# EAGLE design LiPower-Shield (EAGLE 6.4)
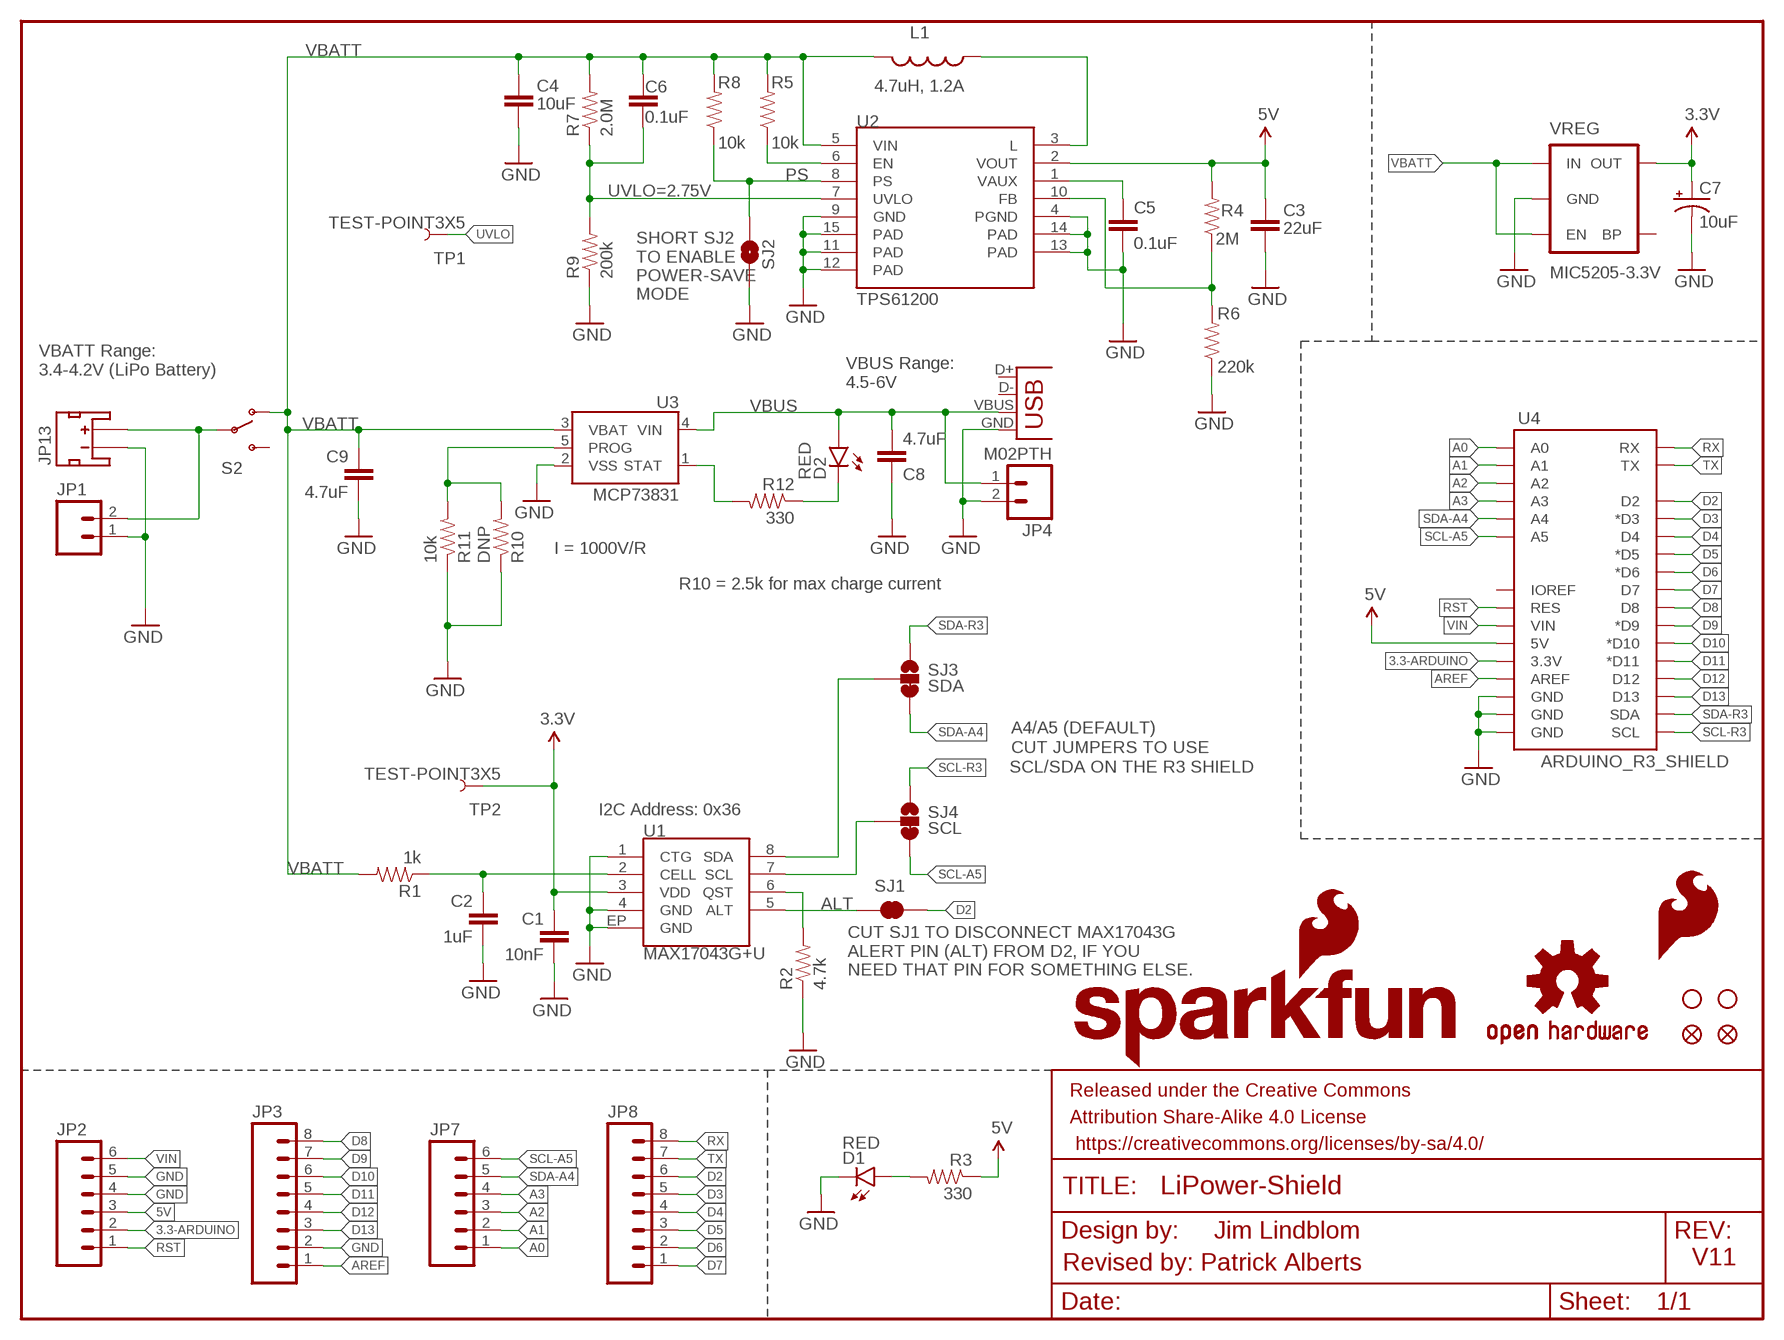
[diagram p0: schematic, sheet 1]

## Parts
C1  10nF  10NF/10000PF-50V-10%(0603)  [0603-CAP]
C2  1uF  1.0UF-16V-10%(0603)  [0603-CAP]
C3  22uF  22UF-6.3V-20%(0805)  [0805]
C4  10uF  10UF-6.3V-20%(1206)  [1206]
C5  0.1uF  0.1UF-25V(+80/-20%)(0603)  [0603-CAP]
C6  0.1uF  0.1UF-25V(+80/-20%)(0603)  [0603-CAP]
C7  10uF  10UF-16V-10%(TANT)  [EIA3216]
C8  4.7uF  4.7UF-6.3V-10%(0603)0603  [0603-CAP]
C9  4.7uF  4.7UF-6.3V-10%(0603)0603  [0603-CAP]
D1  RED  LED-RED0603  [LED-0603]
D2  RED  LED-RED0603  [LED-0603]
FID1  FIDUCIAL1X2  [FIDUCIAL-1X2]
FID2  FIDUCIAL1X2  [FIDUCIAL-1X2]
FRAME1  FRAME-LETTER  [CREATIVE_COMMONS]
JP1  M021X02_NO_SILK  [1X02_NO_SILK]
JP2  M06NO_SILK  [1X06_NO_SILK]
JP3  M08NO_SILK  [1X08_NO_SILK]
JP4  M02PTH  [1X02]
JP7  M06NO_SILK  [1X06_NO_SILK]
JP8  M08NO_SILK  [1X08_NO_SILK]
JP9  STAND-OFFTIGHT  [STAND-OFF-TIGHT]
JP10  STAND-OFFTIGHT  [STAND-OFF-TIGHT]
JP11  USBSMD  [USB-MINIB]
JP13  JST_2MM_MALE  [JST-2-SMD]
L1  4.7uH, 1.2A  INDUCTORINDUCTOR_4.7UH  [INDUCTOR_4.7UH]
LOGO1  OSHW-LOGOS  [OSHW-LOGO-S]
LOGO2  SFE_LOGO_NAME_FLAME.2_INCH  [SFE_LOGO_NAME_FLAME_.2]
LOGO3  SFE_LOGO_FLAME.1_INCH  [SFE_LOGO_FLAME_.1]
R1  1k  1KOHM1/10W1%(0603)  [0603-RES]
R2  4.7k  4.7KOHM1/10W1%(0603)  [0603-RES]
R3  330  330OHM1/10W1%(0603)  [0603-RES]
R4  2M  2MOHMS-1/10W-1%(0603)  [0603-RES]
R5  10k  10KOHM1/10W1%(0603)0603  [0603-RES]
R6  220k  220KOHM1/10W1%(0603)  [0603-RES]
R7  2.0M  2MOHMS-1/10W-1%(0603)  [0603-RES]
R8  10k  10KOHM1/10W1%(0603)0603  [0603-RES]
R9  200k  200KOHM1/10W1%(0603)200K  [0603-RES]
R10  DNP  RESISTORPTH-1/6W  [1/6W-RES]
R11  10k  10KOHM1/10W1%(0603)0603  [0603-RES]
R12  330  330OHM1/10W1%(0603)  [0603-RES]
S2  SWITCH-SPDT-SMD-A  [SWITCH-SPST-SMD-A]
SJ1  SOLDERJUMPERTRACE  [SJ_2S-TRACE]
SJ2  PS  SOLDERJUMPERNO  [SJ_2S-NO]
SJ3  SDA  JUMPER-PAD-3-2OF3_NC_BY_TRACE  [PAD-JUMPER-3-2OF3_NC_BY_TRACE_YES_SILK_FULL_BOX]
SJ4  SCL  JUMPER-PAD-3-2OF3_NC_BY_TRACE  [PAD-JUMPER-3-2OF3_NC_BY_TRACE_YES_SILK_FULL_BOX]
TP1  TEST-POINT3X5  [PAD.03X.05]
TP2  TEST-POINT3X5  [PAD.03X.05]
U1  MAX17043G+U  MAX1704X  [TDFN-8]
U2  TPS61200  [QFN-10_PAD]
U3  MCP73831  [SOT23-5]
U4  ARDUINO_R3_SHIELD  [UNO_R3_SHIELD]
VREG  MIC5205-3.3V  MIC52053.3V  [SOT23-5]

## Nets
3.3-ARDUINO: JP2.2 U4.3.3V
3.3V: C1.1 C7.A(+) TP2.P$1 U1.3(VDD) VREG.5(OUT)
5V: C3.1 JP2.3 R3.1 R4.2 U2.2(VOUT) U4.5V
A0: JP7.1 U4.A0
A1: JP7.2 U4.A1
A2: JP7.3 U4.A2
A3: JP7.4 U4.A3
ALT: SJ1.1 U1.5(ALT)
AREF: JP3.1 U4.AREF
CELL: C2.1 R1.1 U1.2(CELL)
D2: JP8.6 SJ1.2 U4.D2
D3: JP8.5 U4.D3(*D3)
D4: JP8.4 U4.D4
D5: JP8.3 U4.D5(*D5)
D6: JP8.2 U4.D6(*D6)
D7: JP8.1 U4.D7
D8: JP3.8 U4.D8
D9: JP3.7 U4.D9(*D9)
D10: JP3.6 U4.D10(*D10)
D11: JP3.5 U4.D11(*D11)
D12: JP3.4 U4.D12
D13: JP3.3 U4.D13
EN: R5.1 U2.6(EN)
FB: R4.1 R6.2 U2.10(FB)
GND: C1.2 C2.2 C3.2 C4.2 C5.2 C7.C(-) C8.1 C9.2 D1.C JP1.1 JP2.4 JP2.5 JP3.2 JP4.2 JP11.GND JP13.1(-) R2.1 R6.1 R9.1 R10.1 R11.1 SJ2.1 U1.1(CTG) U1.4(GND) U1.EP(GND) U2.4(PGND) U2.9(GND) U2.11(PAD) U2.12(PAD) U2.13(PAD) U2.14(PAD) U2.15(PAD) U3.2(VSS) U4.GND@0(GND) U4.GND@1(GND) U4.GND@2(GND) VREG.2(GND)
N$1: D1.A R3.2
N$3: L1.P$1 U2.3(L)
N$4: C5.1 U2.1(VAUX)
N$5: D2.C R12.1
N$7: JP1.2 JP13.2(+) S2.2(P)
N$20: SJ3.2 U1.8(SDA)
PROG: R10.2 R11.2 U3.5(PROG)
PS: R8.1 SJ2.2 U2.8(PS)
QST: R2.2 U1.6(QST)
RST: JP2.1 U4.RES
RX: JP8.8 U4.RX
SCL: SJ4.2 U1.7(SCL)
SCL-A5: JP7.6 SJ4.3 U4.A5
SCL-R3: SJ4.1 U4.SCL
SDA-A4: JP7.5 SJ3.3 U4.A4
SDA-R3: SJ3.1 U4.SDA
STAT: R12.2 U3.1(STAT)
TX: JP8.7 U4.TX
UVLO: C6.2 R7.1 R9.2 TP1.P$1 U2.7(UVLO)
VBATT: C4.1 C6.1 C9.1 L1.P$2 R1.2 R5.2 R7.2 R8.2 S2.1(O) U2.5(VIN) U3.3(VBAT) VREG.1(IN) VREG.3(EN)
VBUS: C8.2 D2.A JP4.1 JP11.VBUS U3.4(VIN)
VIN: JP2.6 U4.VIN
Unconnected: JP11.D+ JP11.D- JP13.NC1(PAD1) JP13.NC2(PAD2) S2.3(S) U4.IOREF VREG.4(BP)

## Notes on the sheet
- UVLO=2.75V
- SHORT SJ2 
  TO ENABLE
  POWER-SAVE
  MODE
- VBATT Range:
  3.4-4.2V (LiPo Battery)
- VBUS Range:
  4.5-6V
- I = 1000V/R
- R10 = 2.5k for max charge current
- A4/A5 (DEFAULT)
- CUT JUMPERS TO USE
- SCL/SDA ON THE R3 SHIELD
- I2C Address: 0x36
- CUT SJ1 TO DISCONNECT MAX17043G 
  ALERT PIN (ALT) FROM D2, IF YOU 
  NEED THAT PIN FOR SOMETHING ELSE.
- Jim Lindblom
- Revised by: Patrick Alberts | V11

## Library data of the parts
C1 = SparkFun-Capacitors:10NF/10000PF-50V-10%(0603): CAP-00867; PROD_ID: CAP-00867
C2 = SparkFun-Capacitors:1.0UF-16V-10%(0603): CAP-00868; PROD_ID: CAP-00868; VALUE: 1.0uF
C3 = SparkFun-Capacitors:22UF-6.3V-20%(0805): CAP-08402 Ceramic; PROD_ID: CAP-08402
C4 = SparkFun-Capacitors:10UF-6.3V-20%(1206): CAP-10057 Ceramic; PROD_ID: CAP-10057
C5 C6 = SparkFun-Capacitors:0.1UF-25V(+80/-20%)(0603): CAP-00810 Ceramic Standard decoupling cap; PROD_ID: CAP-00810
C7 = SparkFun-Capacitors:10UF-16V-10%(TANT): CAP-00811 1206/EIA-3216 Tantalum capacitor; PROD_ID: CAP-00811
C8 C9 = SparkFun-Capacitors:4.7UF-6.3V-10%(0603): CAP-08280; PROD_ID: CAP-08280
D1 D2 = SparkFun-LED:LED-RED: Assorted Red LEDs LilyPad 1206- DIO-09912 1206- DIO-00809 0603- DIO-00819; PROD_ID: DIO-00819
FID1 FID2 = SparkFun-Aesthetics:FIDUCIAL: Fiducial Alignment Points Various fiducial points for machine vision alignment.
FRAME1 = SparkFun-Aesthetics:FRAME-LETTER: Schematic Frame Standard 8.5x11 US Letter frame
JP1 = SparkFun:M02: Header 2 Standard 2-pin 0.1" header. Use with straight break away headers (SKU : PRT-00116), right angle break away headers (PRT-00553), swiss pins (PRT-00743), machine pins (PRT-00117), and female headers (PRT-00115). Molex polarized connector foot print use with SKU : PRT-08233 with associated crimp pins and housings.
JP2 JP7 = SparkFun-Connectors:M06: Header 6 Standard 6-pin 0.1" header. Use with straight break away headers (SKU : PRT-00116), right angle break away headers (PRT-00553), swiss pins (PRT-00743), machine pins (PRT-00117), and female headers (PRT-00115). Molex polarized connector foot print use with SKU : PRT-08094 with associated crimp pins and housings. NOTES ON THE VARIANTS LOCK and LOCK_LONGPADS... This footprint was designed to help hold the alignment of a through-hole component (i.e. 6-pin header) while soldering it into place. You may notice that each hole has been shifted either up or down by 0.005 of an inch from it's more standard position (which is a perfectly straight line). This slight alteration caused the pins (the squares in the middle) to touch the edges of the holes. Because they are alternating, it causes a "brace" to hold the component in place. 0.005 has proven to be the perfect amount of "off-center" position when using our standard breakaway headers. Although looks a little odd when you look at the bare footprint, once you have a header in there, the alteration is very hard to notice. Also,if you push a header all the way into place, it is covered up entirely on the bottom side. This idea of altering the position of holes to aid alignment will be further integrated into the Sparkfun Library for other footprints. It can help hold any component with 3 or more connection pins.
JP3 JP8 = SparkFun-Connectors:M08: Header 8 Standard 8-pin 0.1" header. Use with straight break away headers (SKU : PRT-00116), right angle break away headers (PRT-00553), swiss pins (PRT-00743), machine pins (PRT-00117), and female headers (PRT-00115).
JP4 = SparkFun-Connectors:M02: Standard 2-pin 0.1" header. Use with - straight break away headers ( PRT-00116) - right angle break away headers (PRT-00553) - swiss pins (PRT-00743) - machine pins (PRT-00117) - female headers (PRT-00115) Molex polarized connector foot print use with: PRT-08233 with associated crimp pins and housings. 2.54_SCREWTERM for use with PRT-10571. 3.5mm Screw Terminal footprints for PRT-08084 5mm Screw Terminal footprints for use with PRT-08432
JP9 JP10 = SparkFun:STAND-OFF: Stand Off This is the mechanical footprint for a #4 phillips button head screw. Use the keepout ring to avoid running the screw head into surrounding components. SKU : PRT-00447
JP11 = SparkFun-Connectors:USB: USB Connectors USB-B-PTH is fully proven SKU : PRT-00139/CONN-08278 USB-miniB is fully proven SKU : PRT-00587 USB-A-PCB is untested. USB-A-H is throughly reviewed, but untested. Spark Fun Electronics SKU : PRT-00437 USB-B-SMT is throughly reviewed, but untested. Needs silkscreen touching up. USB-A-S has not been used/tested USB-MB-H has not been used/tested USB-MICROB has been used. CONN-09505; PROD_ID: CONN-08193
JP13 = SparkFun-Connectors:JST_2MM_MALE: Mates to single-cell LiPo batteries. CONN-08352; PROD_ID: CONN-08352
L1 = SparkFun-Passives:INDUCTOR: Inductors Basic Inductor/Choke - 0603 and 1206. Footprints are not proven and vary greatly between part numbers. SRN6045- 33uH, 20% 1.4A SDR0403-560KL - 56uH, 10%, 500mA RMS/740mA peak; PROD_ID: NDUC-10146
LOGO1 = SparkFun-Aesthetics:OSHW-LOGO: Open Source Hardware Logo This logo indicates the piece of hardware it is found on incorporates a OSHW license and/or adheres to the definition of open source hardware found here: http://freedomdefined.org/OSHW
LOGO2 = SparkFun-Aesthetics:SFE_LOGO_NAME_FLAME: SFE Logo, name and flame This is the SparkFun full logo. The logo on the schematic will always be the same size; the package variant is the height of the flame part of the logo. Default layer for the logo on the board is tSilk.
LOGO3 = SparkFun-Aesthetics:SFE_LOGO_FLAME: SFE Logo, flame only This is the SparkFun flame logo. The logo on the schematic will always be the same size; the package variant is the height of the flame. Default layer for the logo on the board is tSilk.
R1 = SparkFun-Resistors:1KOHM1/10W1%(0603): RES-07856; PROD_ID: RES-07856; VALUE: 1K
R2 = SparkFun-Resistors:4.7KOHM1/10W1%(0603): RES-07857; PROD_ID: RES-07857; VALUE: 4.7K
R3 R12 = SparkFun-Resistors:330OHM1/10W1%(0603): RES-00818; PROD_ID: RES-00818
R4 = SparkFun-Resistors:2MOHMS-1/10W-1%(0603): RES-10054; PROD_ID: RES-10054; VALUE: 2.0M
R5 R8 R11 = SparkFun-Resistors:10KOHM1/10W1%(0603): RES-00824; PROD_ID: RES-00824; VALUE: 10K
R6 = SparkFun-Resistors:220KOHM1/10W1%(0603): RES-08969; PROD_ID: RES-08969
R7 = SparkFun-Resistors:2MOHMS-1/10W-1%(0603): RES-10054; PROD_ID: RES-10054
R9 = SparkFun-Resistors:200KOHM1/10W1%(0603): RES-09385; PROD_ID: RES-09385
R10 = SparkFun-Resistors:RESISTOR: Resistor Basic schematic elements and footprints for 0603, 1206, and PTH resistors.
S2 = SparkFun-Electromechanical:SWITCH-SPDT: SPDT Switch Simple slide switch, Spark Fun Electronics SKU : COM-00102 DPDT SMT slide switch, AYZ0202, SWCH-08179
SJ1 SJ2 = SparkFun:SOLDERJUMPER: Solder Jumper Standard SMD solder jumper. Used to automate production. Two varients : Normally Open and Normally Closed are the same, but have different paste layers. NC will have a large amount of paste and should jumper during reflow.
SJ3 SJ4 = SparkFun-Passives:JUMPER-PAD-3-2OF3_NC_BY_TRACE
TP1 TP2 = SparkFun-Passives:TEST-POINT: Bare copper test points for troubleshooting or ICT
U1 = SparkFun-PowerIC:MAX1704X: MAX17043/MAX17044: Battery Fuel Guage (43 is 1cell, 44 is 2cell); PROD-ID: IC-10399
U2 = SparkFun-PowerIC:TPS61200: DC to DC Booster IC-10035; PROD_ID: IC-10035
U3 = SparkFun-PowerIC:MCP73831: Miniature single cell, fully integrated Li-Ion, Li-polymer charge management controller http://ww1.microchip.com/downloads/en/DeviceDoc/21984a.pdf IC-09995; PROD_ID: IC-09995
U4 = SparkFun-Boards:ARDUINO_R3_SHIELD: Shield form compatible with the Arduino Uno R3.
VREG = SparkFun-PowerIC:MIC5205: MIC5205 150mA vreg 3.3V - VREG-00822 5V - VREG-00823; PROD_ID: VREG-00822

## Board
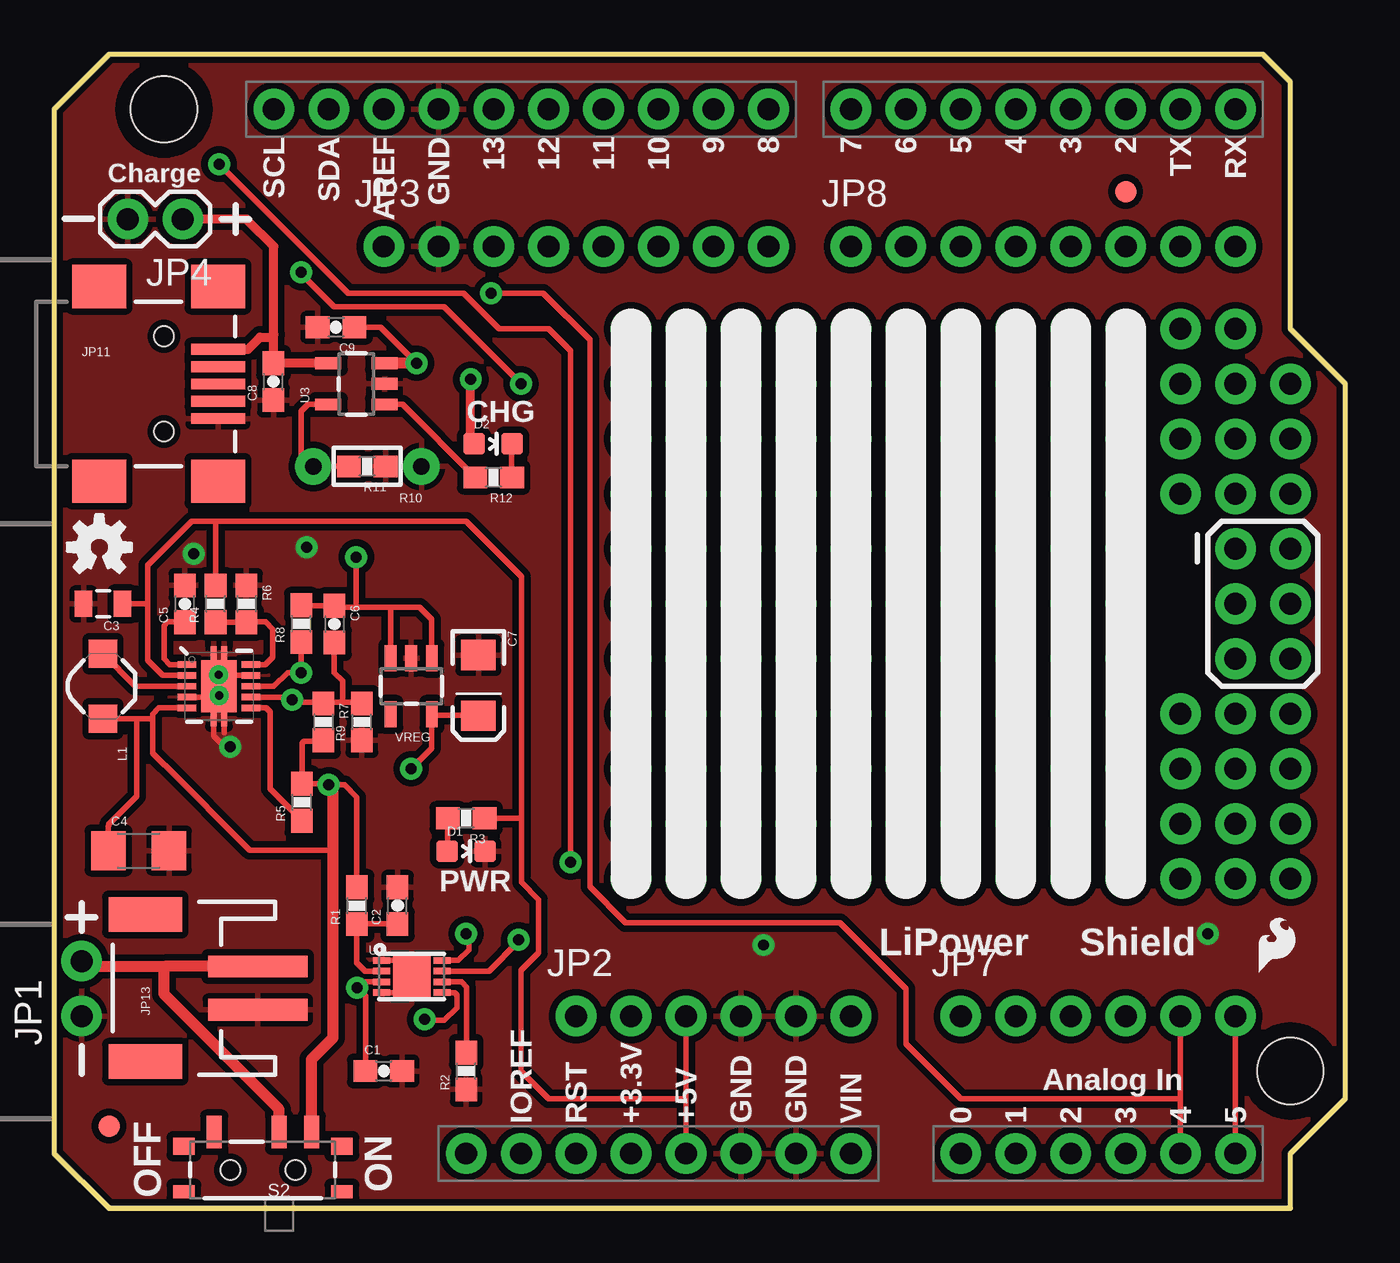
[diagram p1: board, top side]
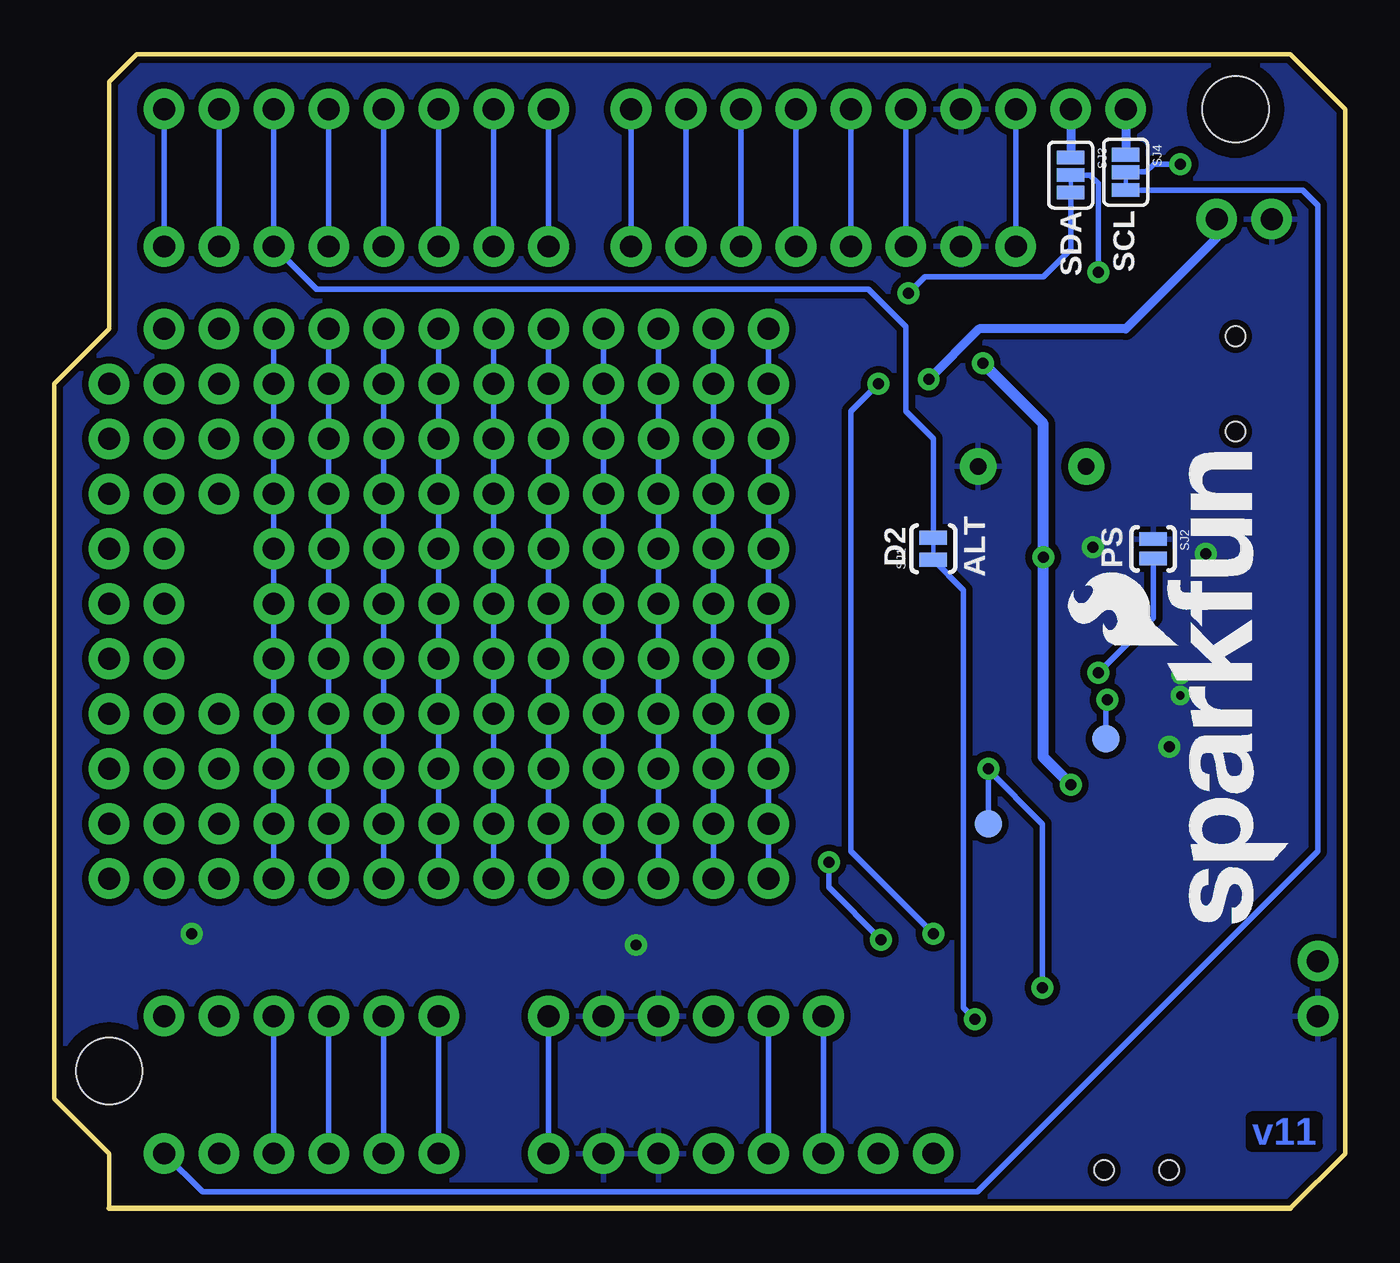
[diagram p2: board, bottom side, seen from below]

Size 59.69 x 53.34 mm. Coordinates in mm from the lower left corner, seen from the top.
Outline: 0,2.54 0,50.8 2.54,53.34 55.88,53.34 57.15,52.07 57.15,40.64 59.69,38.1 59.69,5.08 57.15,2.54 57.15,0 2.54,0 0,2.54
Copper layers (1*16): Top 0.035mm / dielectric 1.5mm / Bottom 0.035mm
Design rules "SparkFun-2-layer": minimum track width 7mil, minimum drill 15mil, track to track 8mil, track to pad 8mil, pad to pad 8mil, via to via 8mil, smd to smd 8mil, copper to edge 8mil, drill to drill 8mil, minimum pad ring 12mil, minimum via ring 10mil, stop-mask expansion 4mil, vias tented up to drill 20mil, thermal gap 10mil

### Footprints (pad centres in the part's own frame; a part is rotated, then mirrored left to right if it is on the bottom)
0603-CAP = smd 1.1 x 1: 1 -0.85,0; 2 0.85,0
0805 = smd 0.8 x 1.2: 1 -0.9,0; 2 0.9,0
1206 = smd 1.6 x 1.8: 1 -1.4,0; 2 1.4,0
EIA3216 = smd 1.4 x 1.6: A 1.4,0; C -1.4,0
LED-0603 = smd 1 x 1: A 0,-0.877; C 0,0.877
FIDUCIAL-1X2 = smd 1 x 1: 1 0,0
1X02_NO_SILK = drill 1.016 pad 1.88: 1 0,0; 2 2.54,0
1X06_NO_SILK = drill 1.016 pad 1.88: 1 0,0; 2 2.54,0; 3 5.08,0; 4 7.62,0; 5 10.16,0; 6 12.7,0
1X08_NO_SILK = drill 1.016 pad 1.88: 1 0,0; 2 2.54,0; 3 5.08,0; 4 7.62,0; 5 10.16,0; 6 12.7,0; 7 15.24,0; 8 17.78,0
1X02 = drill 1.016 pad 1.88: 1 0,0; 2 2.54,0
STAND-OFF-TIGHT = hole 3.048: 0,0
USB-MINIB = smd 2.5 x 0.5: D+ 2.5,0; D- 2.5,0.8; GND 2.5,-1.6; ID 2.5,-0.8; VBUS 2.5,1.6 | smd 2.5 x 2: MTN1 -3,4.5; MTN2 2.5,4.5; MTN3 -3,-4.5; MTN4 2.5,-4.5 | hole 0.9: 0,2.2; 0,-2.2
JST-2-SMD = smd 1 x 4.6: 1 -1,-3.7; 2 1,-3.7 | smd 1.6 x 3.4: NC1 -3.4,1.5; NC2 3.4,1.5
INDUCTOR_4.7UH = smd 1.3 x 1.3: P$1 -1.5,0; P$2 1.5,0
0603-RES = smd 1.1 x 1: 1 -0.85,0; 2 0.85,0
1/6W-RES = drill 0.762 pad 1.676: 1 -2.5,0; 2 2.5,0
SWITCH-SPST-SMD-A = smd 0.7 x 1.5: 1 -2.25,-1.75; 2 -0.75,-1.75; 3 2.25,-1.75 | smd 1 x 0.6: GND1 -3.65,1; GND3 3.65,1 | smd 1 x 0.8: GND2 -3.65,-1.1; GND4 3.65,-1.1 | hole 0.9: -1.5,0; 1.5,0
SJ_2S-TRACE = smd 0.635 x 1.27: 1 -0.508,0; 2 0.508,0
SJ_2S-NO = smd 0.635 x 1.27: 1 -0.45,0; 2 0.45,0
PAD-JUMPER-3-2OF3_NC_BY_TRACE_YES_SILK_FULL_BOX = smd 0.635 x 1.27: 1 -0.813,0; 2 0,0; 3 0.813,0
PAD.03X.05 = smd 1.27 x 1.27: P$1 0,0
TDFN-8 = smd 0.8 x 0.3: 1 -1.4,0.75; 2 -1.4,0.25; 3 -1.4,-0.25; 4 -1.4,-0.75; 5 1.4,-0.75; 6 1.4,-0.25; 7 1.4,0.25; 8 1.4,0.75 | smd 1.73 x 1.88: EP 0,0
QFN-10_PAD = smd 0.297 x 0.85: 1 -1,-1.475; 2 -0.5,-1.475; 3 0,-1.475; 4 0.5,-1.475; 5 1,-1.475; 6 1,1.475; 7 0.5,1.475; 8 0,1.475; 9 -0.5,1.475; 10 -1,1.475 | smd 0.7 x 0.28: 11 -1.5,0.25; 12 -1.5,-0.25; 13 1.5,0.25; 14 1.5,-0.25 | smd 2.4 x 1.65: 15 0,0
SOT23-5 = smd 0.55 x 1.2: 1 -0.95,-1.3; 2 0,-1.3; 3 0.95,-1.3; 4 0.95,1.3; 5 -0.95,1.3
UNO_R3_SHIELD = drill 1.016 pad 1.88: 3.3V 50.8,26.67; 5V 50.8,29.21; A0 50.8,41.91; A1 50.8,44.45; A2 50.8,46.99; A3 50.8,49.53; A4 50.8,52.07; A5 50.8,54.61; AREF 2.54,15.24; D2 2.54,49.53; D3 2.54,46.99; D4 2.54,44.45; D5 2.54,41.91; D6 2.54,39.37; D7 2.54,36.83; D8 2.54,33.02; D9 2.54,30.48; D10 2.54,27.94; D11 2.54,25.4; D12 2.54,22.86; D13 2.54,20.32; GND@0 50.8,31.75; GND@1 50.8,34.29; GND@2 2.54,17.78; IOREF 50.8,21.59; NC 50.8,19.05; RES 50.8,24.13; RX 2.54,54.61; SCL 2.54,10.16; SDA 2.54,12.7; TX 2.54,52.07; VIN 50.8,36.83

### Placement (x,y rotation side)
C1  15.24,6.35 0 top
C2  15.88,14 90 top
C3  2.26,27.94 180 top
C4  3.91,16.54 0 top
C5  6.05,27.94 90 top
C6  12.95,27 270 top
C7  19.61,24.17 270 top
C8  10.14,38.2 90 top
C9  13.03,40.72 180 top
D1  19.05,16.51 270 top
D2  20.29,35.33 270 top
FID1  2.54,3.81 0 top
FID2  49.53,46.99 0 top
FRAME1  -2.01,-17.78 0 top  (outside the outline)
JP1  1.27,8.89 90 top
JP2  24.13,8.89 0 top
JP3  15.24,44.45 0 top
JP4  5.95,45.72 180 top
JP7  41.91,8.89 0 top
JP8  36.83,44.45 0 top
JP9  5.08,50.8 0 top
JP10  57.15,6.35 0 top
JP11  5.08,38.1 0 top
JP13  5.72,10.18 90 top
L1  2.26,24.13 270 top
LOGO1  2.09,30.56 0 top
LOGO2  2.54,12.45 90 bottom
LOGO3  55.37,10.54 0 top
R1  14,14 90 top
R2  19.05,6.35 90 top
R3  19.05,18.03 180 top
R4  7.47,27.94 90 top
R5  11.46,18.77 90 top
R6  8.89,27.94 270 top
R7  12.45,22.48 270 top
R8  11.43,27.03 90 top
R9  14.22,22.48 90 top
R10  14.48,34.29 180 top
R11  14.48,34.29 180 top
R12  20.32,33.78 180 top
S2  9.65,1.78 180 top
SJ1  19.05,30.48 90 bottom
SJ2  8.89,30.48 270 bottom
SJ3  12.7,47.75 270 bottom
SJ4  10.16,47.88 270 bottom
TP1  11.08,21.71 0 bottom
TP2  16.51,17.78 0 bottom
U1  16.54,10.72 0 top
U2  7.62,24.13 270 top
U3  13.97,38.1 90 top
U4  0,53.34 270 top
VREG  16.51,24.13 180 top

### Tracks (layer width: path | path; a pad name or v marks a point on that pad's centre or on a via)
3.3-ARDUINO
  Bottom 0.254: U4.3.3V JP2.2
3.3V  (via drill 0.51)
  Top 0.254: v16.51,20.32 17.46,21.27 VREG.5 17.56,22.73 17.61,22.78 C7.A | U1.3 14.28,10.47 v14.01,10.2 14.39,9.82 C1.1 14.1,6.64
  Bottom 0.254: v14.01,10.2 14.01,17.77 16.51,20.26 v16.51,20.32 TP2.P$1
5V
  Top 0.254: 21.61,29.18 19.05,31.75 7.47,31.75 | 7.47,31.75 6.35,31.75 4.32,29.72 4.32,27.94 | 7.47,31.75 R4.2 | 4.32,27.94 4.32,25.32 5.01,24.63 U2.2 | 21.61,18.01 21.61,17.78 21.61,15.06 22.4,14.28 22.4,11.81 21.59,11 21.59,6.35 22.86,5.08 29.21,5.08 | 21.61,29.18 21.61,18.01 arc90 21.61,18.01 | 21.61,29.18 arc90 21.61,29.18 | JP2.3 29.21,5.08 | 29.21,5.08 U4.5V | C3.1 4.32,27.94 | R3.1 21.61,18.03 21.61,18.01
A0
  Bottom 0.254: JP7.1 U4.A0
A1
  Bottom 0.254: U4.A1 JP7.2 44.45,9.13
A2
  Bottom 0.254: JP7.3 U4.A2
A3
  Bottom 0.254: JP7.4 U4.A3
ALT  (via drill 0.51)
  Top 0.254: U1.5 18.5,9.97 18.62,9.86 18.62,9.27 18.03,8.69 17.17,8.69 v17.12,8.74
  Bottom 0.254: v17.12,8.74 17.65,9.27 17.65,28.57 SJ1.1
AREF
  Bottom 0.254: U4.AREF JP3.1
CELL
  Top 0.254: U1.2 14.38,10.97 13.99,11.35 R1.1 C2.1 15.85,13.17
D2
  Bottom 0.254: SJ1.2 19.05,35.56 20.32,36.83 20.32,40.74 22.05,42.47 47.57,42.47 47.57,42.49 JP8.6 U4.D2
D3
  Bottom 0.254: U4.D3 JP8.5
D4
  Bottom 0.254: U4.D4 JP8.4
D5
  Bottom 0.254: U4.D5 JP8.3
D6
  Bottom 0.254: U4.D6 JP8.2
D7
  Bottom 0.254: U4.D7 JP8.1
D8
  Bottom 0.254: U4.D8 JP3.8
D9
  Bottom 0.254: U4.D9 JP3.7
D10
  Bottom 0.254: U4.D10 JP3.6
D11
  Bottom 0.254: U4.D11 JP3.5
D12
  Bottom 0.254: U4.D12 JP3.4
D13
  Bottom 0.254: U4.D13 JP3.3
EN
  Top 0.254: U2.6 9.81,23.13 9.98,22.96 9.98,19.39 R5.1
FB
  Top 0.254: R4.1 R6.2 8.9,27.1 9.78,27.1 10.11,26.77 10.11,25.48 9.76,25.13 U2.10
GND  (via drill 0.38, 0.51)
  Top 0.254: U1.1 15.79,11.47 U1.EP 15.79,9.97 U1.4 | U2.13 7.87,21.98 | 7.75,21.46 7.37,21.84 U2.14 7.37,23.88 U2.15 | U2.11 7.87,24.38 U2.15 | U2.12 7.37,24.38 U2.15 | U2.4 7.12,23.63 U2.15 | U2.9 8.12,24.63 U2.15
  other vias: 6.45,30.25 11.68,30.56 8.13,21.34 32.78,12.17 53.34,12.7 7.61,24.66 7.63,23.7
  pour Bottom (isolate 0.305): 0,0 0,53.34 59.69,53.34 59.69,0
  pour Top (isolate 0.305): 0,0 0,53.34 59.69,53.34 59.69,0
N$1
  Top 0.254: D1.A 18.2,16.54 R3.2
N$3
  Top 0.254: U2.3 3.76,24.13 L1.P$1
N$4
  Top 0.254: U2.1 5.35,25.13 5.08,25.4 5.08,26.92 5.26,27.1 6.03,27.1 C5.1
N$5
  Top 0.254: D2.C 21.14,35.3 21.14,33.81 R12.1
N$7
  Top 0.508: 5.08,11.16 1.54,11.16 JP1.2 | S2.2 10.4,4.58 5.08,9.91 5.08,11.16 | JP13.2 5.1,11.18 5.08,11.16
N$8  (via drill 1.02 pad 1.88)
  other vias: 52.07,40.64
N$9  (via drill 1.02 pad 1.88)
  other vias: 54.61,40.64
N$10  (via drill 1.02 pad 1.88)
  other vias: 52.07,38.1
N$11  (via drill 1.02 pad 1.88)
  other vias: 54.61,38.1
N$12  (via drill 1.02 pad 1.88)
  other vias: 57.15,38.1
N$13  (via drill 1.02 pad 1.88)
  other vias: 52.07,35.56
N$14  (via drill 1.02 pad 1.88)
  other vias: 54.61,35.56
N$15  (via drill 1.02 pad 1.88)
  other vias: 57.15,35.56
N$16  (via drill 1.02 pad 1.88)
  other vias: 52.07,33.02
N$17  (via drill 1.02 pad 1.88)
  other vias: 54.61,33.02
N$18  (via drill 1.02 pad 1.88)
  other vias: 57.15,33.02
N$19  (via drill 1.02 pad 1.88)
  other vias: 54.61,30.48
N$20  (via drill 0.51)
  Top 0.254: U1.8 18.68,11.47 19.18,11.96 19.18,12.57 v19.05,12.7 | v21.59,38.1 18.03,41.66 12.95,41.66 11.43,43.18 v11.43,43.25
  Bottom 0.254: v19.05,12.7 22.86,16.51 22.86,36.83 v21.59,38.1 | v11.43,43.25 11.43,47.37 11.81,47.75 SJ3.2
N$21  (via drill 1.02 pad 1.88)
  other vias: 57.15,30.48
N$22  (via drill 1.02 pad 1.88)
  other vias: 54.61,27.94
N$23  (via drill 1.02 pad 1.88)
  other vias: 57.15,27.94
N$24  (via drill 1.02 pad 1.88)
  other vias: 54.61,25.4
N$25  (via drill 1.02 pad 1.88)
  other vias: 57.15,25.4
N$26  (via drill 1.02 pad 1.88)
  other vias: 52.07,22.86
N$27  (via drill 1.02 pad 1.88)
  other vias: 54.61,22.86
N$28  (via drill 1.02 pad 1.88)
  other vias: 57.15,22.86
N$29  (via drill 1.02 pad 1.88)
  other vias: 52.07,20.32
N$30  (via drill 1.02 pad 1.88)
  other vias: 54.61,20.32
N$31  (via drill 1.02 pad 1.88)
  other vias: 57.15,20.32
N$32  (via drill 1.02 pad 1.88)
  other vias: 52.07,17.78
N$33  (via drill 1.02 pad 1.88)
  other vias: 52.07,15.24
N$34  (via drill 1.02 pad 1.88)
  other vias: 54.61,17.78
N$35  (via drill 1.02 pad 1.88)
  other vias: 54.61,15.24
N$36  (via drill 1.02 pad 1.88)
  other vias: 57.15,17.78
N$37  (via drill 1.02 pad 1.88)
  other vias: 57.15,15.24
P1  (via drill 1.02 pad 1.88)
  Bottom 0.254: v26.67,40.64 v26.67,38.1 v26.67,35.56 v26.67,33.02 v26.67,30.48 v26.67,27.94 v26.67,25.4 v26.67,22.86 v26.67,20.32 v26.67,17.78 v26.67,15.24
P2  (via drill 1.02 pad 1.88)
  Bottom 0.254: v29.21,40.64 v29.21,38.1 v29.21,35.56 v29.21,33.02 v29.21,30.48 v29.21,27.94 v29.21,25.4 v29.21,22.86 v29.21,20.32 v29.21,17.78 v29.21,15.24
P3  (via drill 1.02 pad 1.88)
  Bottom 0.254: v31.75,40.64 v31.75,38.1 v31.75,35.56 v31.75,33.02 v31.75,30.48 v31.75,27.94 v31.75,25.4 v31.75,22.86 v31.75,20.32 v31.75,17.78 v31.75,15.24
P4  (via drill 1.02 pad 1.88)
  Bottom 0.254: v34.29,40.64 v34.29,38.1 v34.29,35.56 v34.29,33.02 v34.29,30.48 v34.29,27.94 v34.29,25.4 v34.29,22.86 v34.29,20.32 v34.29,17.78 v34.29,15.24
P5  (via drill 1.02 pad 1.88)
  Bottom 0.254: v36.83,40.64 v36.83,38.1 v36.83,35.56 v36.83,33.02 v36.83,30.48 v36.83,27.94 v36.83,25.4 v36.83,22.86 v36.83,20.32 v36.83,17.78 v36.83,15.24
P6  (via drill 1.02 pad 1.88)
  Bottom 0.254: v39.37,40.64 v39.37,38.1 v39.37,35.56 v39.37,33.02 v39.37,30.48 v39.37,27.94 v39.37,25.4 v39.37,22.86 v39.37,20.32 v39.37,17.78 v39.37,15.24
P7  (via drill 1.02 pad 1.88)
  Bottom 0.254: v41.91,15.24 v41.91,17.78 v41.91,20.32 v41.91,22.86 v41.91,25.4 v41.91,27.94 v41.91,30.48 v41.91,33.02 v41.91,35.56 v41.91,38.1 v41.91,40.64
P8  (via drill 1.02 pad 1.88)
  Bottom 0.254: v44.45,40.64 v44.45,38.1 v44.45,35.56 v44.45,33.02 v44.45,30.48 v44.45,27.94 v44.45,25.4 v44.45,22.86 v44.45,20.32 v44.45,17.78 v44.45,15.24
P9  (via drill 1.02 pad 1.88)
  Bottom 0.254: v46.99,15.24 v46.99,17.78 v46.99,20.32 v46.99,22.86 v46.99,25.4 v46.99,27.94 v46.99,30.48 v46.99,33.02 v46.99,35.56 v46.99,38.1 v46.99,40.64
P10  (via drill 1.02 pad 1.88)
  Bottom 0.254: v49.53,40.64 v49.53,38.1 v49.53,35.56 v49.53,33.02 v49.53,30.48 v49.53,27.94 v49.53,25.4 v49.53,22.86 v49.53,20.32 v49.53,17.78 v49.53,15.24
PROG
  Top 0.254: R11.2 R10.2 11.43,34.84 11.43,36.83 11.75,37.15 U3.5
PS  (via drill 0.51)
  Top 0.254: R8.1 v11.43,24.77 10.79,24.77 10.16,24.13 U2.8
  Bottom 0.254: SJ2.2 8.89,27.3 v11.43,24.77
QST
  Top 0.254: U1.6 18.82,10.47 19.07,10.22 19.07,7.22 R2.2
RST
  Bottom 0.254: U4.RES JP2.1
RX
  Bottom 0.254: U4.RX JP8.8
SCL  (via drill 0.51)
  Top 0.254: U1.7 20.09,10.97 21.46,12.34 v21.46,12.42 | v23.88,16 23.88,39.62 22.86,40.64 20.57,40.64 18.92,42.29 13.59,42.29 v7.62,48.26
  Bottom 0.254: 21.46,12.06 v21.46,12.42 23.88,14.83 v23.88,16 | 10.21,47.93 SJ4.2 10.14,47.9 9.22,47.9 8.86,48.26 v7.62,48.26
SCL-A5
  Top 0.254: JP7.6 U4.A5
  Bottom 0.254: SJ4.3 10.13,47.04 1.96,47.04 1.27,46.35 1.27,16.51 17.02,0.76 52.83,0.76 U4.A5
SCL-R3
  Bottom 0.406: U4.SCL SJ4.1
SDA-A4  (via drill 0.51)
  Top 0.254: v20.19,42.29 22.61,42.29 24.77,40.13 24.77,14.86 26.42,13.21 36.32,13.21 39.37,10.16 39.37,7.62 41.91,5.08 52.07,5.08 | JP7.5 52.07,5.08 | 52.07,5.08 U4.A4
  Bottom 0.254: SJ3.3 12.7,44.32 13.97,43.05 19.43,43.05 v20.19,42.29
SDA-R3
  Bottom 0.406: U4.SDA SJ3.1
STAT
  Top 0.254: U3.1 16.1,37.15 R12.2
TX
  Bottom 0.254: U4.TX JP8.7
UVLO  (via drill 0.51)
  Top 0.254: U2.7 10.87,23.63 v11.01,23.5 11.12,23.38 12.39,23.38 R7.1 12.5,23.38 13.34,23.38 | R9.2 14.17,23.38 13.34,23.38 | C6.2 12.95,24.77 13.34,24.38 13.34,23.38
  Bottom 0.254: TP1.P$1 11.08,23.43 v11.01,23.5
VBATT  (via drill 0.51)
  Top 0.254: VREG.1 17.46,27.22 16.89,27.79 15.49,27.79 | VREG.3 15.56,27.73 15.55,27.73 15.49,27.79 | U2.5 4.84,23.13 4.55,22.84 4.55,22.63 | L1.P$2 3.81,22.63 | 3.81,22.63 4.55,22.63 | 4.55,22.63 4.55,21.03 5.11,20.47 5.13,20.47 9.04,16.56 12.84,16.56 12.89,16.51 | C9.1 15.1,40.72 v16.76,39.05 | R8.2 11.46,27.85 C6.1 13.02,27.79 13.97,27.79 | 15.49,27.79 13.97,27.79 | v13.97,30.1 13.97,27.79 | R1.2 13.99,19 13.42,19.57 12.71,19.57 v12.7,19.58 12.7,19.62 R5.2 11.46,21.49 11.56,21.59 12.41,21.59 R7.2 | C4.1 2.51,17.65 arc-45 2.59,17.83 3.81,19.05 3.81,22.63
  Top 0.508: v16.76,39.05 U3.3 | S2.1 11.9,6.89 12.89,7.88 12.89,16.51 12.89,19.39 v12.7,19.58
  Bottom 0.508: v16.76,39.05 13.97,36.26 v13.97,30.1 | 14,30.07 v13.97,30.1 | v12.7,19.58 13.97,20.85 v13.97,30.1
VBUS  (via drill 0.51)
  Top 0.406: D2.A 19.25,35.5 19.25,38.29 v19.26,38.31 | JP4.1 8.89,45.72 10.16,44.45 10.16,40.39 | U3.4 C8.2 10.16,39.05 10.16,40.39 | JP11.VBUS 8.97,39.7 9.53,40.26 10.03,40.26 10.16,40.39
  Bottom 0.406: JP4.1 5.95,44.85 10.16,40.64 16.93,40.64 v19.26,38.31
VIN
  Bottom 0.254: U4.VIN JP2.6

### Text on the board
Bottom: v11
tPlace: Charge | CHG | PWR | LiPower | Shield | OFF | ON
bPlace: SCL | SDA | ALT | PS | D2
tDocu: Jim Lindblom | Revised by: Patrick Alberts